# Altium project PCB_Project1.PrjPCB
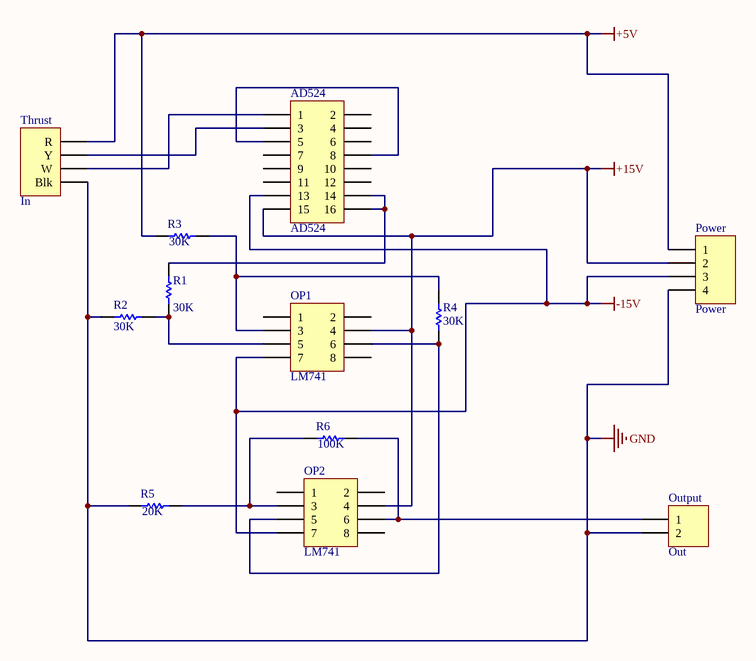
[diagram p0: Sheet1.SchDoc]
1 sheet, 12 parts. Net scope: global (net labels, ports and power ports of the same name join across sheets).
Board file: rocket_project_pcb.PcbDoc

## Sheet Sheet1.SchDoc
size A

### Parts
AD524  AD524  [HDR2X8]
OP1  LM741  [HDR2X4]
OP2  LM741  [HDR2X4]
Output  Out  [HDR1X2]
Power  Power  [HDR1X4]
R1  value 30K  [AXIAL-0.3]  (hidden comment: Res1)
R2  value 30K  [AXIAL-0.3]  (hidden comment: Res2)
R3  value 30K  [AXIAL-0.3]  (hidden comment: Res3)
R4  value 30K  [AXIAL-0.3]  (hidden comment: Res4)
R5  value 20K  [AXIAL-0.3]  (hidden comment: Res5)
R6  value 100K  [AXIAL-0.3]  (hidden comment: Res6)
Thrust  In  [HDR1X4]

### Nets
+5V: Power.1 R3.1 Thrust.1(R)
+15V: AD524.15 OP1.4 OP2.4 Power.2
-15V: AD524.13 OP1.7 OP2.7 Power.3
GND: Output.2 Power.4 R2.2 R5.1 Thrust.4(Blk)
NetAD524_1: AD524.1 Thrust.3(W)
NetAD524_3: AD524.3 Thrust.2(Y)
NetAD524_5: AD524.5 AD524.8
NetAD524_14: AD524.14 AD524.16 R1.2
NetOP1_3: OP1.3 R3.2 R4.2
NetOP1_5: OP1.5 R1.1 R2.1
NetOP1_6: OP1.6 OP2.5 R4.1
NetOP2_3: OP2.3 R5.2 R6.1
NetOP2_6: OP2.6 Output.1 R6.2

Not connected (* = marked no-connect by the designer): AD524 2 4 6 7 9 10 11 12; OP1 1 2 8; OP2 1 2 8

### Library data of the parts
AD524 = Header 8X2: Header, 8-Pin, Dual row; LatestRevisionDate: 17-Jul-2002; LatestRevisionNote: Re-released for DXP Platform.; Publisher: Altium Limited
OP1 OP2 = Header 4X2: Header, 4-Pin, Dual row; LatestRevisionDate: 17-Jul-2002; LatestRevisionNote: Re-released for DXP Platform.; Publisher: Altium Limited
Output = Header 2: Header, 2-Pin; LatestRevisionDate: 17-Jul-2002; LatestRevisionNote: Re-released for DXP Platform.; Publisher: Altium Limited
Power Thrust = Header 4: Header, 4-Pin; LatestRevisionDate: 17-Jul-2002; LatestRevisionNote: Re-released for DXP Platform.; Publisher: Altium Limited
R1-R6 = Res1: Resistor; Published: 8-Jun-2000; LatestRevisionDate: 17-Jul-2002; LatestRevisionNote: Re-released for DXP Platform.; PackageReference: AXIAL-0.3; Publisher: Altium Limited; PackageDescription: Axial Device, Thru-Hole; 2 Leads; 0.3 in Pin Spacing